# EAGLE schematic LACE_module (EAGLE 5.07)
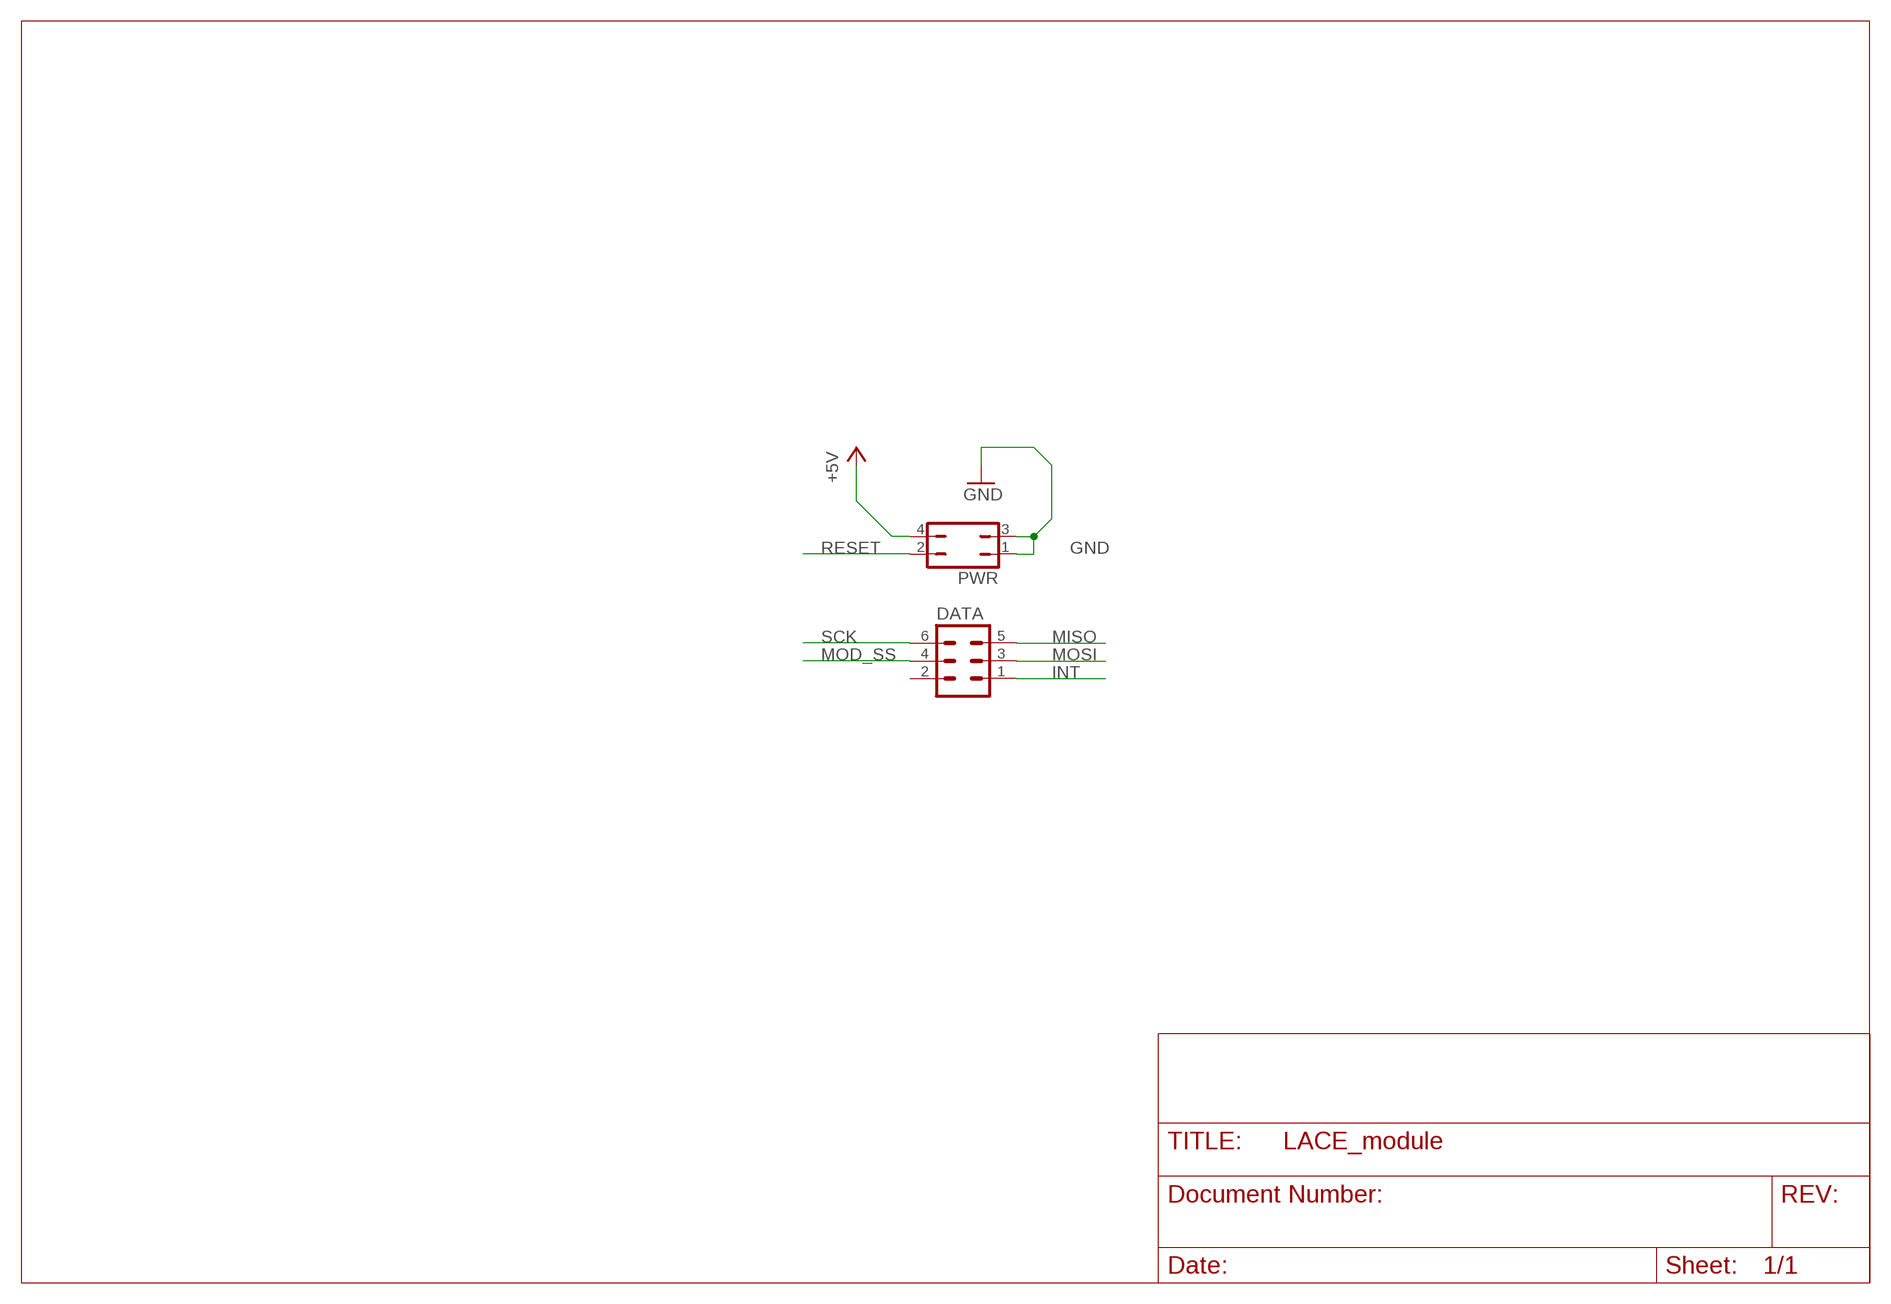
[diagram p0: schematic, sheet 1]

## Parts
DATA  MA03-2  [MA03-2]
PWR  JP2Q  [JP2Q]

## Nets
+5V: PWR.4
GND: PWR.1 PWR.3
INT: DATA.1
MISO: DATA.5
MOD_SS: DATA.4
MOSI: DATA.3
RESET: PWR.2
SCK: DATA.6
Unconnected: DATA.2

## Library data of the parts
DATA = con-lstb:MA03-2: PIN HEADER
PWR = jumper:JP2Q: JUMPER